# EAGLE design elektrosluch (EAGLE 6.4)
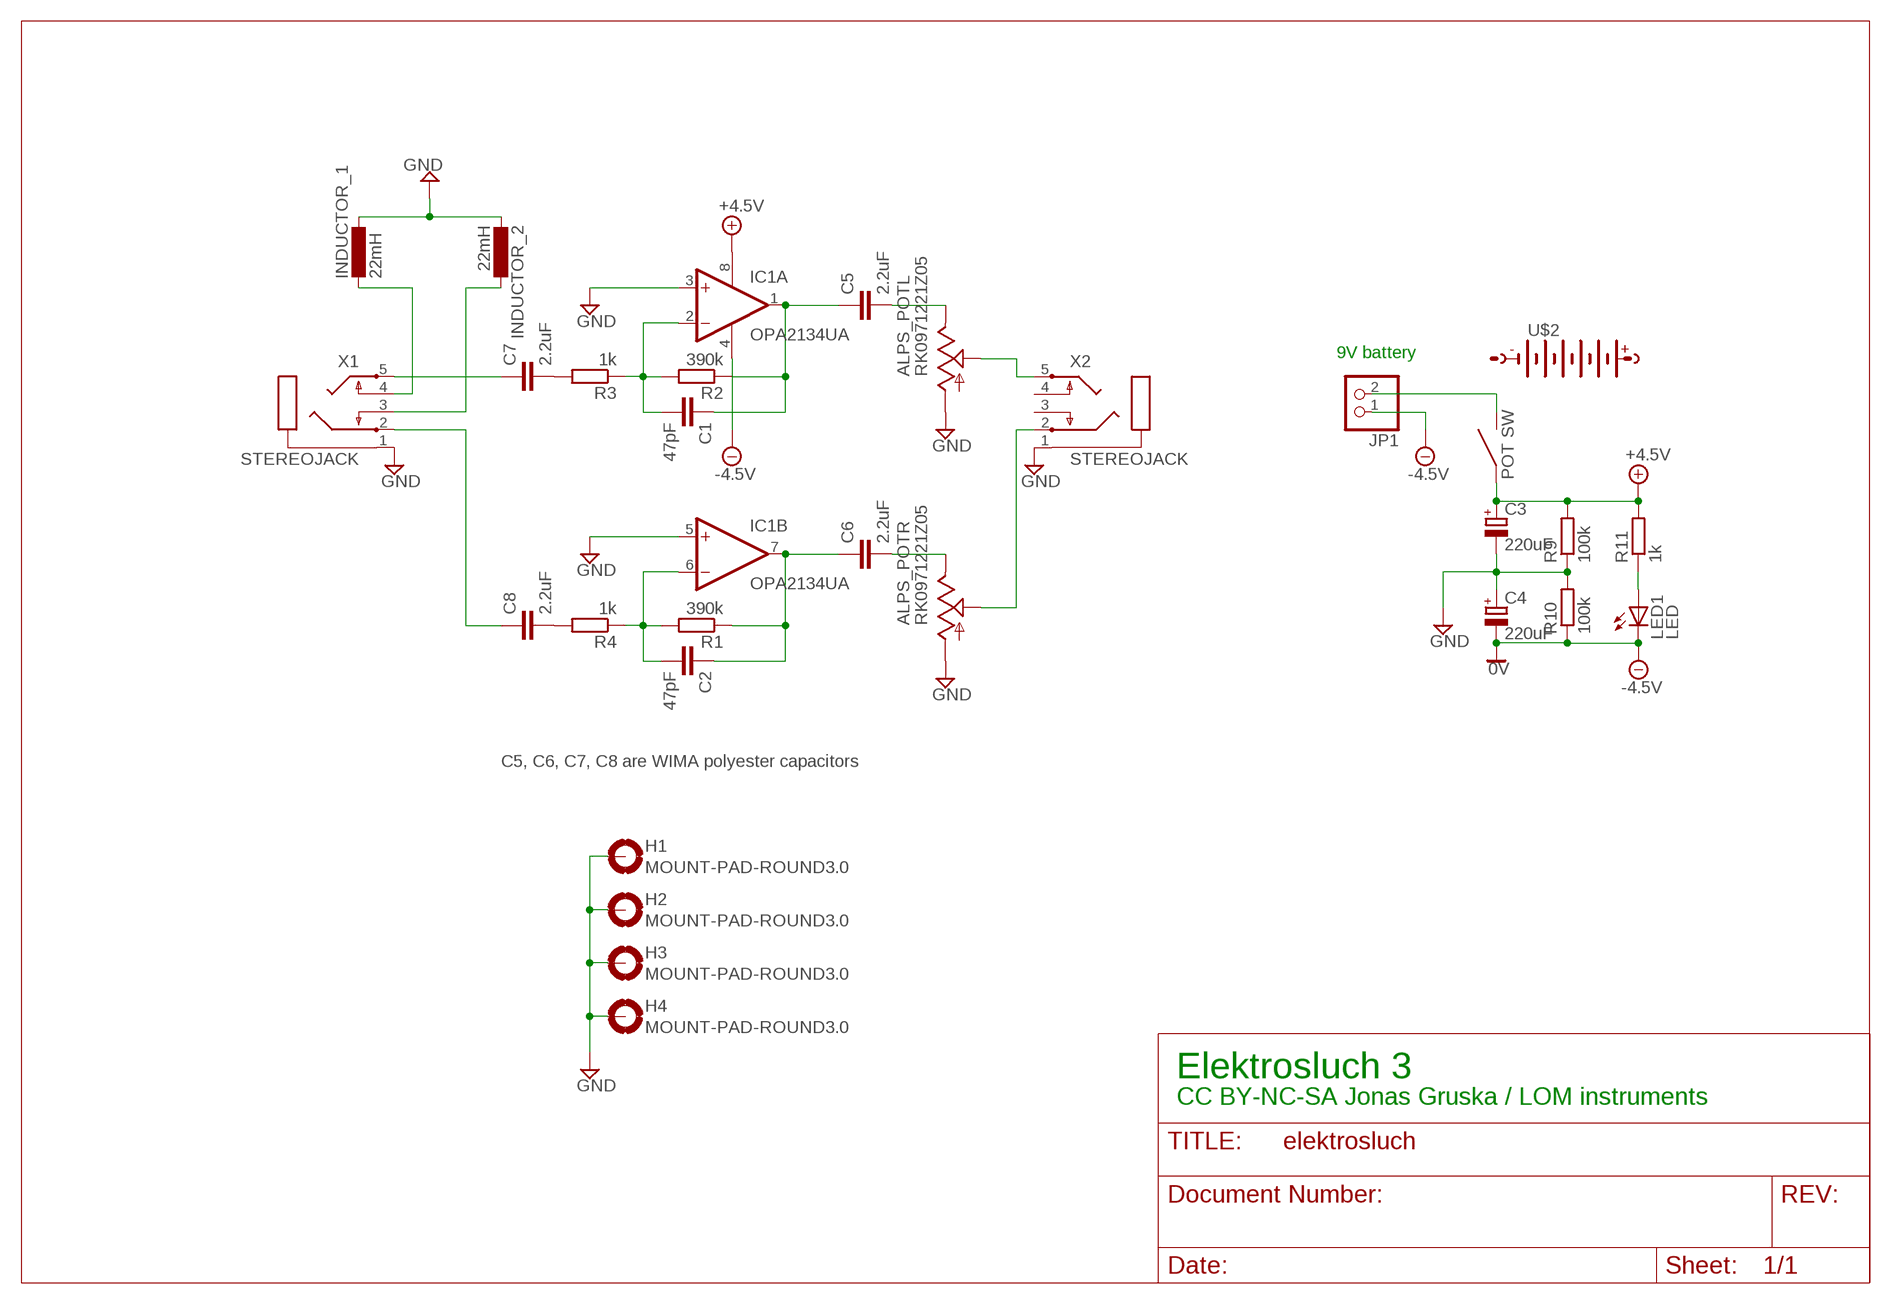
[diagram p0: schematic, sheet 1]

## Parts
ALPS_POT  RK0971221Z05  ALPS_RK0971221Z0N  [ALPS_RK0971221Z0X]
C1  47pF  C-EUC0805  [C0805]
C2  47pF  C-EUC0805  [C0805]
C3  220uF  CPOL-EUD  [PANASONIC_D]
C4  220uF  CPOL-EUD  [PANASONIC_D]
C5  2.2uF  WIMA10UF  [WIMA10UF]
C6  2.2uF  WIMA10UF  [WIMA10UF]
C7  2.2uF  WIMA10UF  [WIMA10UF]
C8  2.2uF  WIMA10UF  [WIMA10UF]
H1  MOUNT-PAD-ROUND3.0  [3,0-PAD]
H2  MOUNT-PAD-ROUND3.0  [3,0-PAD]
H3  MOUNT-PAD-ROUND3.0  [3,0-PAD]
H4  MOUNT-PAD-ROUND3.0  [3,0-PAD]
IC1  OPA2134UA  [SO08]
INDUCTOR_1  22mH  COIL  [COIL]
INDUCTOR_2  22mH  COIL  [COIL]
JP1  PINHD-1X2  [1X02]
LED1  LED  [LED3MM]
R1  390k  R-EU_R0805  [R0805]
R2  390k  R-EU_R0805  [R0805]
R3  1k  R-EU_R0805  [R0805]
R4  1k  R-EU_R0805  [R0805]
R9  100k  R-EU_R0805  [R0805]
R10  100k  R-EU_R0805  [R0805]
R11  1k  R-EU_R0805  [R0805]
U$2  BATT  [BATT]
X1  STEREOJACK  [STX3100]
X2  STEREOJACK  [STX3100]

## Nets
+5V: ALPS_POT.S1 C3.+ IC1.8(A:V+) R9.2 R11.2 ; supply symbol labelled +4.5V
-5V: C4.- IC1.4(A:V-) JP1.1 LED1.K(C) R10.1 ; supply symbol labelled -4.5V, 0V
GND: ALPS_POT.G1 ALPS_POT.G2 C3.- C4.+ H1.B3,0(MOUNT) H2.B3,0(MOUNT) H3.B3,0(MOUNT) H4.B3,0(MOUNT) IC1.3(A:+IN) IC1.5(B:+IN) INDUCTOR_1.P$1 INDUCTOR_2.P$2 R9.1 R10.2 X1.1 X2.1
N$1: C1.2 IC1.2(A:-IN) R2.2 R3.1
N$2: C1.1 C5.P$1 IC1.1(A:OUT) R2.1
N$3: ALPS_POT.I1 C5.P$2
N$4: C2.2 IC1.6(B:-IN) R1.2 R4.1
N$5: C2.1 C6.P$1 IC1.7(B:OUT) R1.1
N$6: ALPS_POT.I2 C6.P$2
N$7: ALPS_POT.O1 X2.5
N$8: C7.P$1 X1.5
N$9: ALPS_POT.O2 X2.2
N$10: C8.P$1 X1.2
N$11: C7.P$2 R3.2
N$12: INDUCTOR_1.P$2 X1.4
N$13: INDUCTOR_2.P$1 X1.3
N$14: LED1.A R11.1
N$15: C8.P$2 R4.2
N$16: ALPS_POT.S2 JP1.2
Unconnected: X2.3 X2.4

## Notes on the sheet
- 9V battery
- C5, C6, C7, C8 are WIMA polyester capacitors
- Elektrosluch 3
- CC BY-NC-SA Jonas Gruska / LOM instruments

## Library data of the parts
ALPS_POT = audio-pots:ALPS_RK0971221Z0*: ALPS RK0971221Z Dual-gang 9mm potentiometer for volume control, with SPST switch -05 model: 10K with "volume" taper -0N model: 50K with traditional audio taper
C1 C2 = rcl:C-EU: CAPACITOR, European symbol
C3 C4 = rcl:CPOL-EU: POLARIZED CAPACITOR, European symbol
C5-C8 = mojakniznica:WIMA10UF
H1-H4 = holes:MOUNT-PAD-ROUND: MOUNTING PAD, round
IC1 = linear:OPA2*: Dual Operational Amplifier Low Power, Single-Supply, Rail-To-Rail Operational Amplifier Source: http://focus.ti.com/lit/ds/symlink/opa2345.pdf http://focus.ti.com .. opa241.pdf http://focus.ti.com/lit/ds/symlink/opa2134.pdf
INDUCTOR_1 INDUCTOR_2 = mojakniznica:COIL
JP1 = pinhead:PINHD-1X2: PIN HEADER
LED1 = mojakniznica:LED
R1-R4 R9-R11 = rcl:R-EU_: RESISTOR, European symbol
U$2 = mojakniznica:BATT
X1 X2 = adafruit:STEREOJACK: MIC/HEADPHONE JACK Stereo jack with two switches. Kycon STX3100, CUI SJ1-3555NG and/or 4UCon 05544

## Board
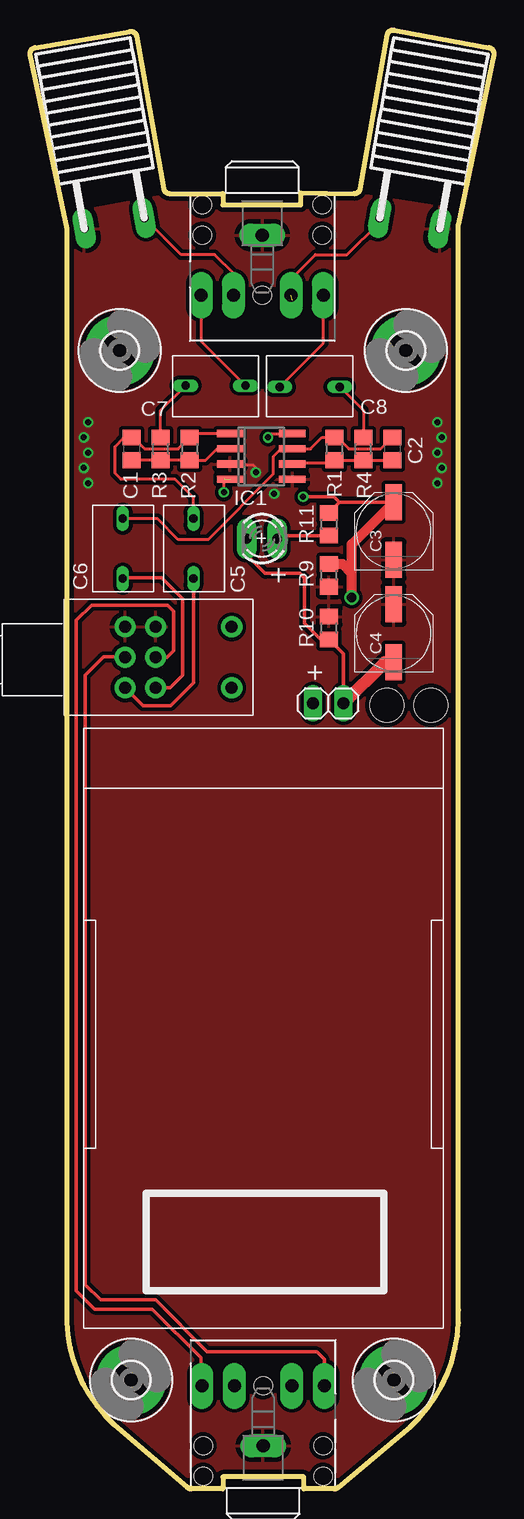
[diagram p1: board, top side]
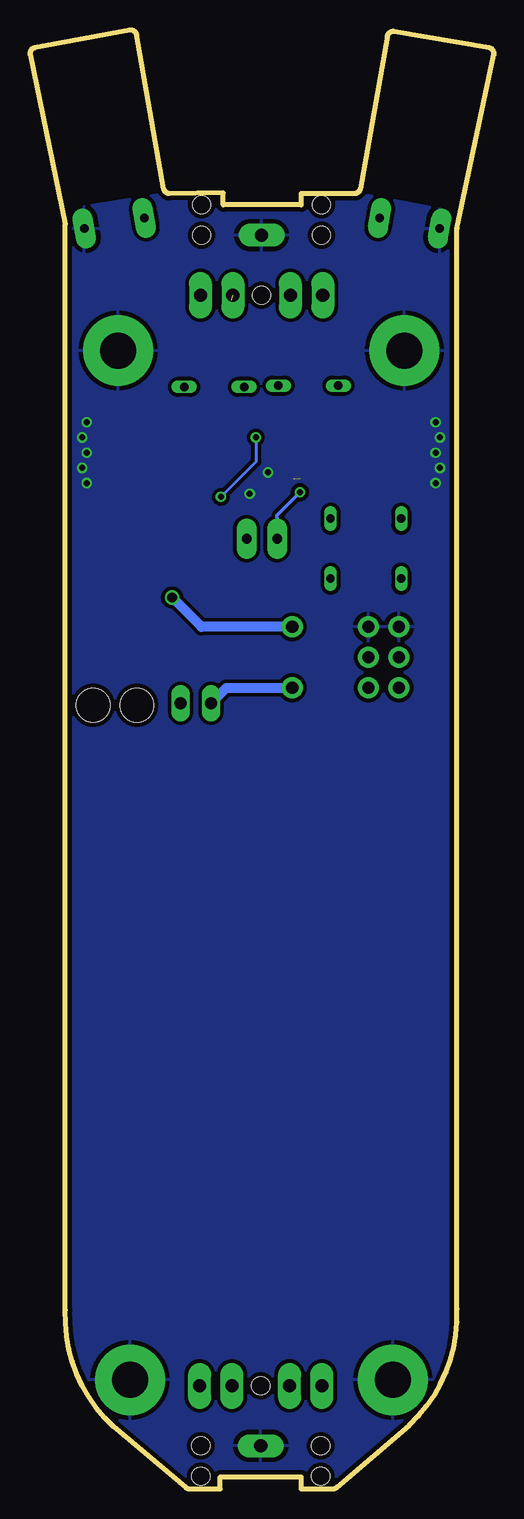
[diagram p2: board, bottom side, seen from below]

Size 38.7 x 121.58 mm. Coordinates in mm from the lower left corner, seen from the top.
Outline: 25.72,0.15 31.72,5.19 arc50 35.74,14.91 35.74,105.41 38.69,119.52 arc90 38.29,120.11 30.39,121.57 arc90 29.8,121.17 27.56,108.36 arc-80 27.06,107.95 22.59,108 22.59,107 16.09,107 16.09,107.95 11.65,107.95 arc-79 11.15,108.36 8.9,121.05 arc89 8.32,121.45 0.42,120.1 arc90 0.01,119.52 3.09,105.03 3.09,14.98 arc50 7.05,5.32 13.11,0.15 arc45 13.47,0 16.09,0 16.09,1 22.84,1 22.84,0 25.36,0 arc45 25.72,0.15
Copper layers (1*16): Top 0.0356mm / dielectric 1.5011mm / Bottom 0.0356mm
Design rules "LaenPCBOrder *": minimum track width 6mil, minimum drill 13mil, track to track 6mil, track to pad 6mil, pad to pad 6mil, via to via 6mil, smd to smd 6mil, copper to edge 15mil, drill to drill 6mil, minimum pad ring 7mil, minimum via ring 7mil, stop-mask expansion 3mil, vias tented up to drill 0mil, thermal gap 15mil
Holes 2.8 mm at 29.78,65.3 33.43,65.3

### Footprints (pad centres in the part's own frame; a part is rotated, then mirrored left to right if it is on the bottom)
ALPS_RK0971221Z0X = drill 1.016 pad 1.778: G1 10.74,2.26; G2 8.2,2.26; I1 10.74,7.34; I2 8.2,7.34; O1 10.74,4.8; O2 8.2,4.8; S1 1.85,2.26; S2 1.85,7.34
C0805 = smd 1.3 x 1.5: 1 -0.95,0; 2 0.95,0
PANASONIC_D = smd 3 x 1.4: + 2.4,0; - -2.4,0
WIMA10UF = drill 0.7 long: P$1 -2.5,0; P$2 2.5,0
3,0-PAD = drill 3 pad 5.842: B3,0 0,0
SO08 = smd 0.6 x 2.2: 1 -1.905,-2.6; 2 -0.635,-2.6; 3 0.635,-2.6; 4 1.905,-2.6; 5 1.905,2.6; 6 0.635,2.6; 7 -0.635,2.6; 8 -1.905,2.6
COIL = drill 0.7 pad 1.676 long: P$1 -2.54,0; P$2 2.54,0
1X02 = drill 1.016 long: 1 -1.27,0; 2 1.27,0
LED3MM = drill 0.8 pad 1.676 long: A -1.27,0; K 1.27,0
R0805 = smd 1.3 x 1.5: 1 -0.95,0; 2 0.95,0
STX3100 = drill 1.1 pad 1.93 long: 1 2.7,-0.1; 2 7.7,5; 3 7.7,2.3; 4 7.7,-2.5; 5 7.7,-5.2 | hole 1.5: 2.7,4.9; 2.7,-5.1; 7.7,-0.1; 2.7,4.9; 0.16,4.9; 2.7,-5.1; 0.16,-5.1

### Placement (x,y rotation side)
ALPS_POT  18.67,74.1 180 top
C1  8.49,86.68 270 top
C2  30.21,86.68 270 top
C3  30.34,79.82 90 top
C4  30.34,71.31 90 top
C5  13.64,78.36 270 top
C6  7.73,78.36 270 top
C7  15.48,91.95 180 top
C8  23.34,91.85 0 top
H1  30.36,9.08 0 top
H2  8.43,9.08 0 top
H3  31.35,94.87 0 top
H4  7.48,94.87 0 top
IC1  19.29,86.04 270 top
INDUCTOR_1  7.03,105.47 10 top
INDUCTOR_2  31.67,105.47 350 top
JP1  24.88,65.47 180 top
LED1  19.35,79.18 180 top
R1  25.38,86.68 270 top
R2  13.32,86.68 270 top
R3  10.91,86.68 90 top
R4  27.8,86.68 90 top
R9  24.94,76.14 90 top
R10  24.94,71.75 90 top
R11  24.95,80.39 90 top
U$2  34.46,13.4 90 top
U$3  [ELEKTROSLUCH3]  32.81,30.35 0 top
U$4  [LOM_BACK]  10.46,59.88 0 top
X1  19.48,107.18 270 top
X2  19.35,0.89 90 top

### Tracks (layer width: path | path; a pad name or v marks a point on that pad's centre or on a via)
+5V  (via drill 0.5 pad 0.18, 0.8)
  Top 0.254: IC1.8 21.82,87.88 20.11,87.88 v19.86,87.63
  Top 0.305: C3.+ 25.83,82.22 | 25.83,82.22 R11.2 | v22.78,82.68 25.37,82.68 25.83,82.22
  Top 0.813: 30.07,82.22 C3.+ 26.84,78.73 26.84,76.33 | v26.84,74.3 26.84,76.33 | R9.2 26.08,77.09 26.84,76.33
  Bottom 0.254: v19.86,87.63 19.86,85.6 v22.78,82.68
  Bottom 0.813: ALPS_POT.S1 24.39,71.84 v26.84,74.3
-5V  (via drill 0.5 pad 0.18)  (1 unrouted)
  Top 0.254: v16.18,83.06 16.18,84.2
  Top 0.305: JP1.1 26.15,69.6 R10.1 24.24,70.81 22.91,72.14 22.91,75.91 22.51,76.31 19.62,76.31 18.08,77.85 LED1.K
  Top 1.016: JP1.1 29.59,68.91 C4.-
  Bottom 0.305: v16.18,83.06 18.08,81.15 LED1.K
GND  (via drill 0.5, 0.5 pad 0.18)
  Top 0.254: IC1.3 16.75,85.34 18.59,85.34 18.84,85.09 v18.84,84.71
  other vias: 20.37,82.93 4.49,87.63 4.86,88.9 4.86,86.36 4.49,85.09 4.86,83.82 33.97,88.9 34.34,87.63 33.97,86.36 34.34,85.09 33.97,83.82
  pour Bottom (isolate 0.305): 2.09,106.17 11.22,107.95 27.48,107.95 36.75,106.43 36.88,0 2.09,-0.5
  pour Top (isolate 0.305): 2.46,106.17 11.22,107.82 27.23,107.95 36.88,106.43 36.88,-0.5 2.59,-0.5
N$1
  Top 0.254: IC1.2 16.62,86.61 15.54,86.61 14.66,85.73 R2.2 R3.1 C1.2
N$2
  Top 0.254: IC1.1 13.64,87.95 R2.1 12.37,86.68 9.57,86.68 8.62,87.63 C1.1 7.86,87.63 7.1,86.87 7.1,84.64 7.6,84.14 12.11,84.14 13.64,82.61 C5.P$1
N$3
  Top 0.305: C5.P$2 13.64,67.18 11.73,65.28 9.42,65.28 ALPS_POT.I1
N$4
  Top 0.254: 22.01,85.53 25.19,85.53 R1.2 R4.1 C2.2
  Top 0.305: 22.01,85.53 IC1.6
N$5
  Top 0.254: 21.76,86.55 20.81,86.55 20.3,86.04 20.3,84.58 14.84,79.12 12.37,79.12 10.63,80.86 C6.P$1 | C2.1 29.26,86.68 26.59,86.68 25.64,87.63 R1.1 24.37,87.63 23.42,86.68 IC1.7
  Top 0.305: 21.76,86.55 IC1.7
N$6
  Top 0.305: ALPS_POT.I2 11.69,66.76 12.75,67.82 12.75,74.17 10.97,75.95 7.82,75.95 C6.P$2
N$7
  Top 0.305: X2.5 24.55,10.8 23.92,11.43 14.78,11.43 10.46,15.75 5.89,15.75 4.62,17.02 4.62,67.82 6.14,69.34 7.9,69.34 ALPS_POT.O1
N$8
  Top 0.254: X1.5 14.28,95.65 C7.P$1
N$9
  Top 0.305: ALPS_POT.O2 11.44,69.31 11.99,69.85 11.99,73.15 11.48,73.66 5.13,73.66 3.86,72.39 3.86,16.51 5.38,14.99 10.21,14.99 14.27,10.92 14.27,8.89 14.78,8.38 14.56,8.38 X2.2
N$10
  Top 0.254: C8.P$1 24.48,95.49 X1.2
N$11
  Top 0.254: R3.2 10.91,89.88 C7.P$2
N$12
  Top 0.254: INDUCTOR_1.P$2 12.59,102.85 15.41,102.85 16.98,101.29 X1.4
N$13  (1 unrouted)
  Top 0.254: 21.89,99.06 21.89,100.95 23.8,102.85 26.45,102.85 29.17,105.58 INDUCTOR_2.P$1
N$14
  Top 0.305: R11.1 20.88,79.44 LED1.A
N$15
  Top 0.254: C8.P$2 27.8,89.89 R4.2
N$16
  Bottom 0.813: JP1.2 22.31,66.76 ALPS_POT.S2

### Text on the board
tNames: + | +
tStop: Designed by / Jonas Gruska / & Birch Cooper